# EAGLE design gatedriver_trafo_sma_compact_ACDC (EAGLE 7.2.0)
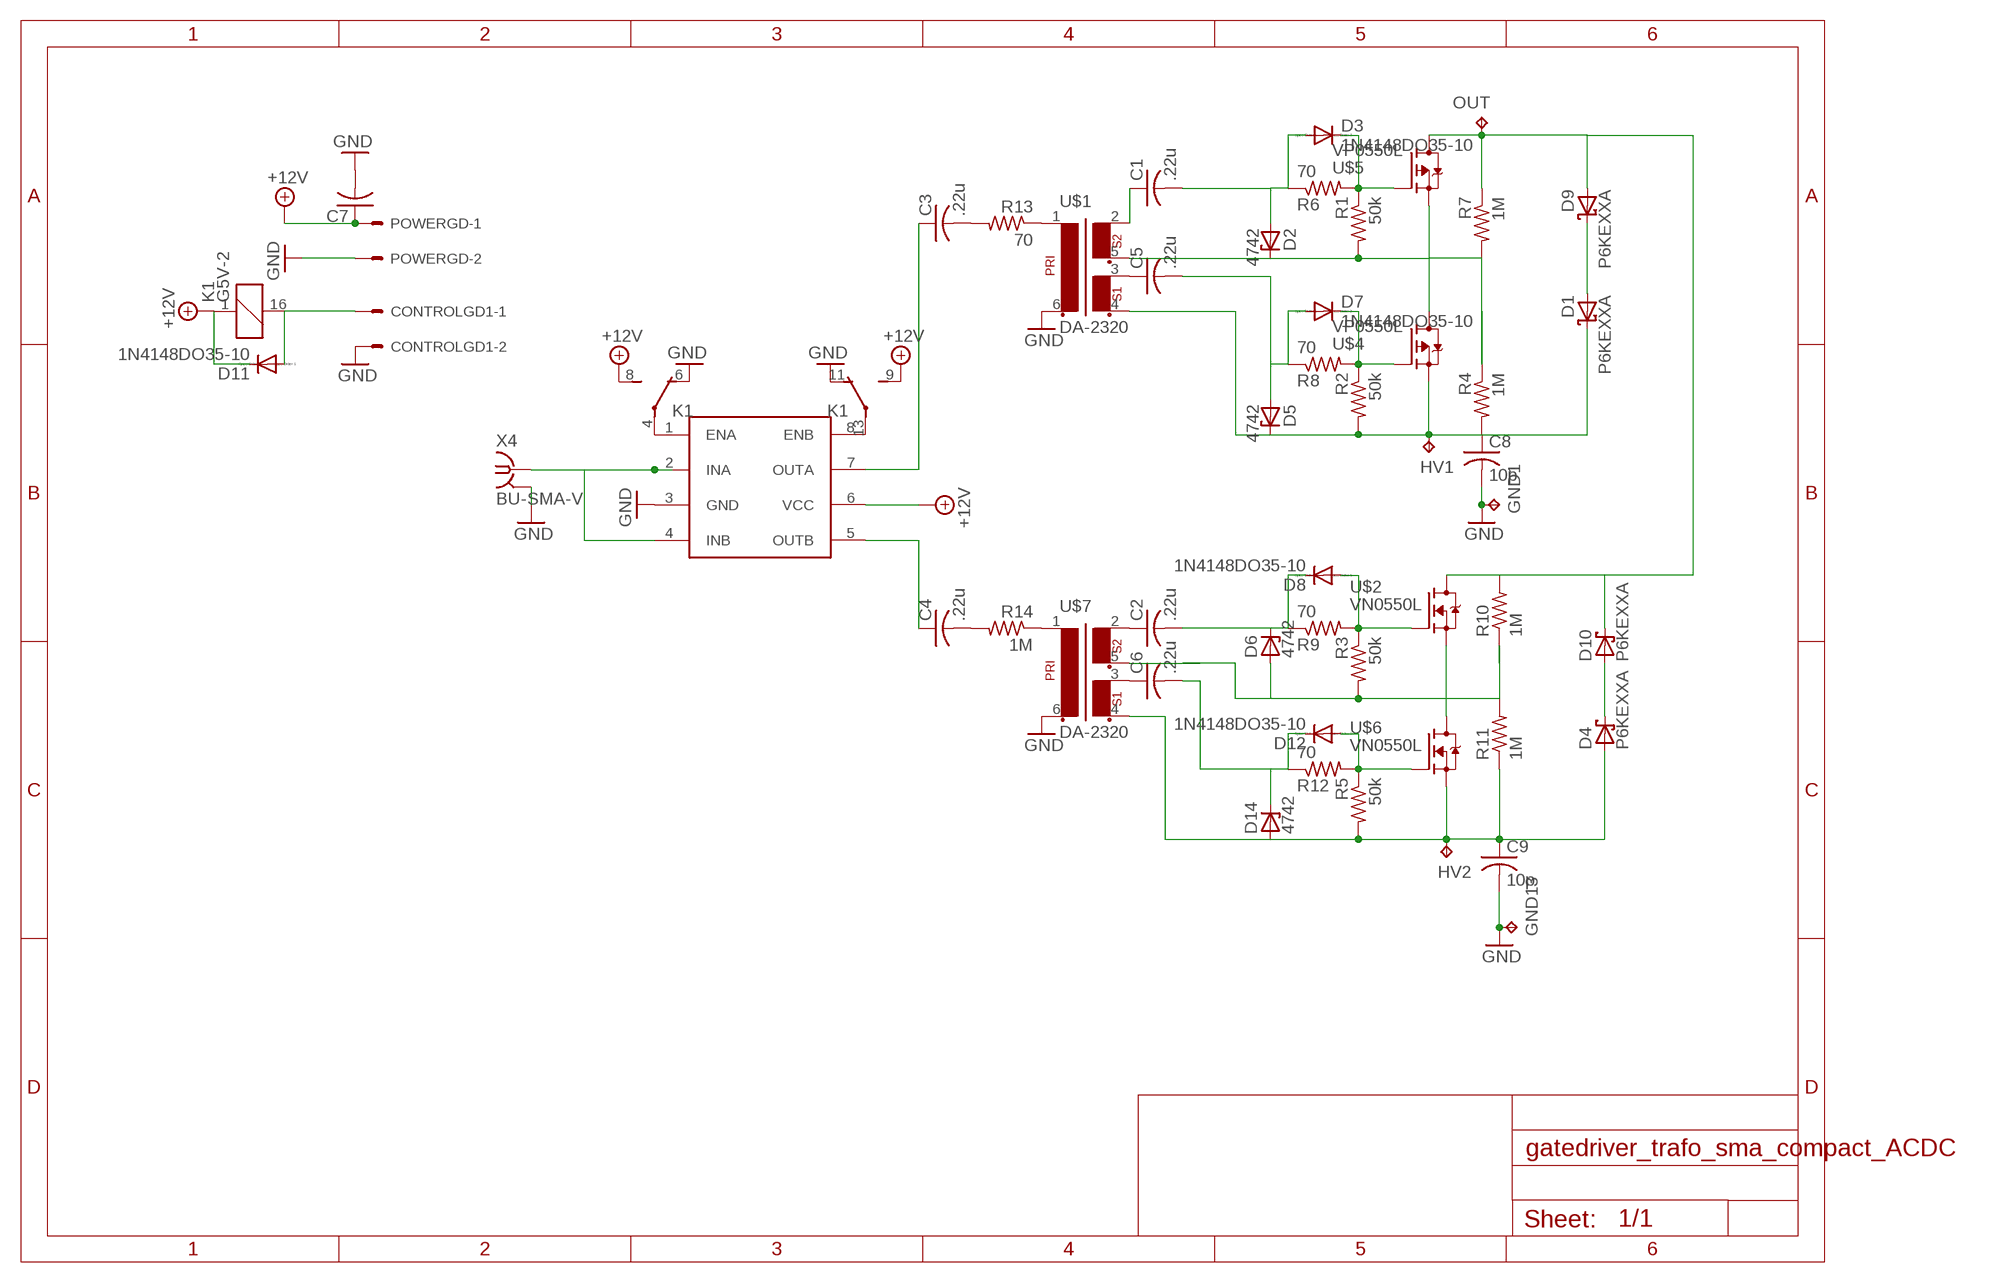
[diagram p0: schematic, sheet 1]

## Parts
C1  .22u  C-US050-055X075  [C050-055X075]
C2  .22u  C-US050-055X075  [C050-055X075]
C3  .22u  C-US050-055X075  [C050-055X075]
C4  .22u  C-US050-055X075  [C050-055X075]
C5  .22u  C-US050-055X075  [C050-055X075]
C6  .22u  C-US050-055X075  [C050-055X075]
C7  C-US050-030X075  [C050-030X075]
C8  10p  C-US102-064X133  [C102-064X133]
C9  10p  C-US102-064X133  [C102-064X133]
CONTROLGD1  KK-156-2  [KK-156-2]
D1  P6KEXXA  [C1702-15]
D2  4742  ZENER-DIODEZD-10  [ZDIO-10]
D3  1N4148DO35-10  [DO35-10]
D4  P6KEXXA  [C1702-15]
D5  4742  ZENER-DIODEZD-10  [ZDIO-10]
D6  4742  ZENER-DIODEZD-10  [ZDIO-10]
D7  1N4148DO35-10  [DO35-10]
D8  1N4148DO35-10  [DO35-10]
D9  P6KEXXA  [C1702-15]
D10  P6KEXXA  [C1702-15]
D11  1N4148DO35-10  [DO35-10]
D12  1N4148DO35-10  [DO35-10]
D14  4742  ZENER-DIODEZD-10  [ZDIO-10]
GND1  TPPAD1-20Y  [P1-20Y]
GND13  TPPAD1-20Y  [P1-20Y]
HV1  TPPAD1-20Y  [P1-20Y]
HV2  TPPAD1-20Y  [P1-20Y]
K1  G5V-2  [G5V-2]
OUT  TPPAD1-20Y  [P1-20Y]
POWERGD  KK-156-2  [KK-156-2]
R1  50k  R-US_0207/10  [0207/10]
R2  50k  R-US_0207/10  [0207/10]
R3  50k  R-US_0207/10  [0207/10]
R4  1M  R-US_0207/10  [0207/10]
R5  50k  R-US_0207/10  [0207/10]
R6  70  R-US_0207/10  [0207/10]
R7  1M  R-US_0207/10  [0207/10]
R8  70  R-US_0207/10  [0207/10]
R9  70  R-US_0207/10  [0207/10]
R10  1M  R-US_0207/10  [0207/10]
R11  1M  R-US_0207/10  [0207/10]
R12  70  R-US_0207/10  [0207/10]
R13  70  R-US_0207/10  [0207/10]
R14  1M  R-US_0207/10  [0207/10]
U$1  DA-2320  [DIL06]
U$2  VN0550L  [TO92L]
U$3  UCC27425  [DIL08]
U$4  VP0550L  [TO92L]
U$5  VP0550L  [TO92L]
U$6  VN0550L  [TO92L]
U$7  DA-2320  [DIL06]
X4  BU-SMA-V  [BU-SMA-V]

## Nets
+15V: C7.1 D11.C K1.1 K1.8(1:S) K1.9(2:S) POWERGD.1 U$3.6(VCC) ; supply symbol labelled +12V
ENSW: CONTROLGD1.1 D11.A K1.16
GND: C7.2 C8.2 C9.2 CONTROLGD1.2 GND1.TP GND13.TP K1.6(1:O) K1.11(2:O) POWERGD.2 U$1.6 U$3.3(GND) U$7.6 X4.2 X4.3 X4.4 X4.5
N$1: U$3.2(INA) U$3.4(INB) X4.1
N$2: C3.1 U$3.7(OUTA)
N$3: R13.1 U$1.1
N$4: C4.1 U$3.5(OUTB)
N$5: C1.1 U$1.2
N$6: R14.1 U$7.1
N$7: C5.1 U$1.3
N$8: D3.C R1.1 R6.2 U$5.2(G)
N$9: U$7.5
N$10: C1.2 D2.A D3.A R6.1
N$11: D12.A R5.1 R12.2 U$6.2(G)
N$12: D7.C R2.1 R8.2 U$4.2(G)
N$13: D6.A R3.2 R10.1 R11.2 U$2.3(S) U$6.1(D)
N$14: K1.4(1:P) U$3.1(ENA)
N$15: K1.13(2:P) U$3.8(ENB)
N$16: C5.2 D5.A D7.A R8.1
N$17: C8.1 D1.C D5.C HV1.TP R2.2 R4.2 U$1.4 U$4.3(S)
N$18: D2.C R1.2 R4.1 R7.2 U$1.5 U$4.1(D) U$5.3(S)
N$19: C3.2 R13.2
N$20: C4.2 R14.2
N$21: D9.A D10.C OUT.TP R7.1 R10.2 U$2.1(D) U$5.1(D)
N$22: C2.1 U$7.2
N$23: C6.1 U$7.3
N$24: C9.1 D4.A D14.A HV2.TP R5.2 R11.1 U$6.3(S) U$7.4
N$25: C2.2 D6.C D8.C R9.1
N$26: D1.A D9.C
N$27: C6.2 D12.C D14.C R12.1
N$28: D4.C D10.A
N$251: D8.A R3.1 R9.2 U$2.2(G)

## Library data of the parts
C1-C6 C8 C9 = resistor:C-US: CAPACITOR, American symbol
C7 = rcl:C-US: CAPACITOR, American symbol
CONTROLGD1 POWERGD = con-molex:KK-156-2: KK 156 HEADER Source: http://www.molex.com/pdm_docs/sd/026604100_sd.pdf; OC_FARNELL: unknown; OC_NEWARK: unknown
D1 D4 D9 D10 = diode:P6KEXXA: DIODE transient-voltage suppressor
D2 D5 D6 D14 = diode:ZENER-DIODE: Z-Diode
D3 D7 D8 D11 D12 = diode:1N4148: DIODE high speed (Philips)
GND1 GND13 HV1 HV2 OUT = testpad:TP: Test pad
K1 = relay:G5V-2: OMRON PCB Relay Source: http://www.omron.com/ecb/products/pdf/en-g5v2.pdf; MPN: G5V-2 5DC; OC_FARNELL: 9949488; OC_NEWARK: 78K5703
R1-R14 = rcl:R-US_: RESISTOR, American symbol
U$1 U$7 = trafo:DA-2320
U$2 U$6 = transistor-fet:VN0550
U$3 = texas:UCC27425
U$4 U$5 = transistor-fet:VP0550
X4 = con-coax:BU-SMA-V: FEMALE SMA CONNECTOR Radiall distributor RS 112-3794; OC_FARNELL: unknown; OC_NEWARK: unknown

## Board
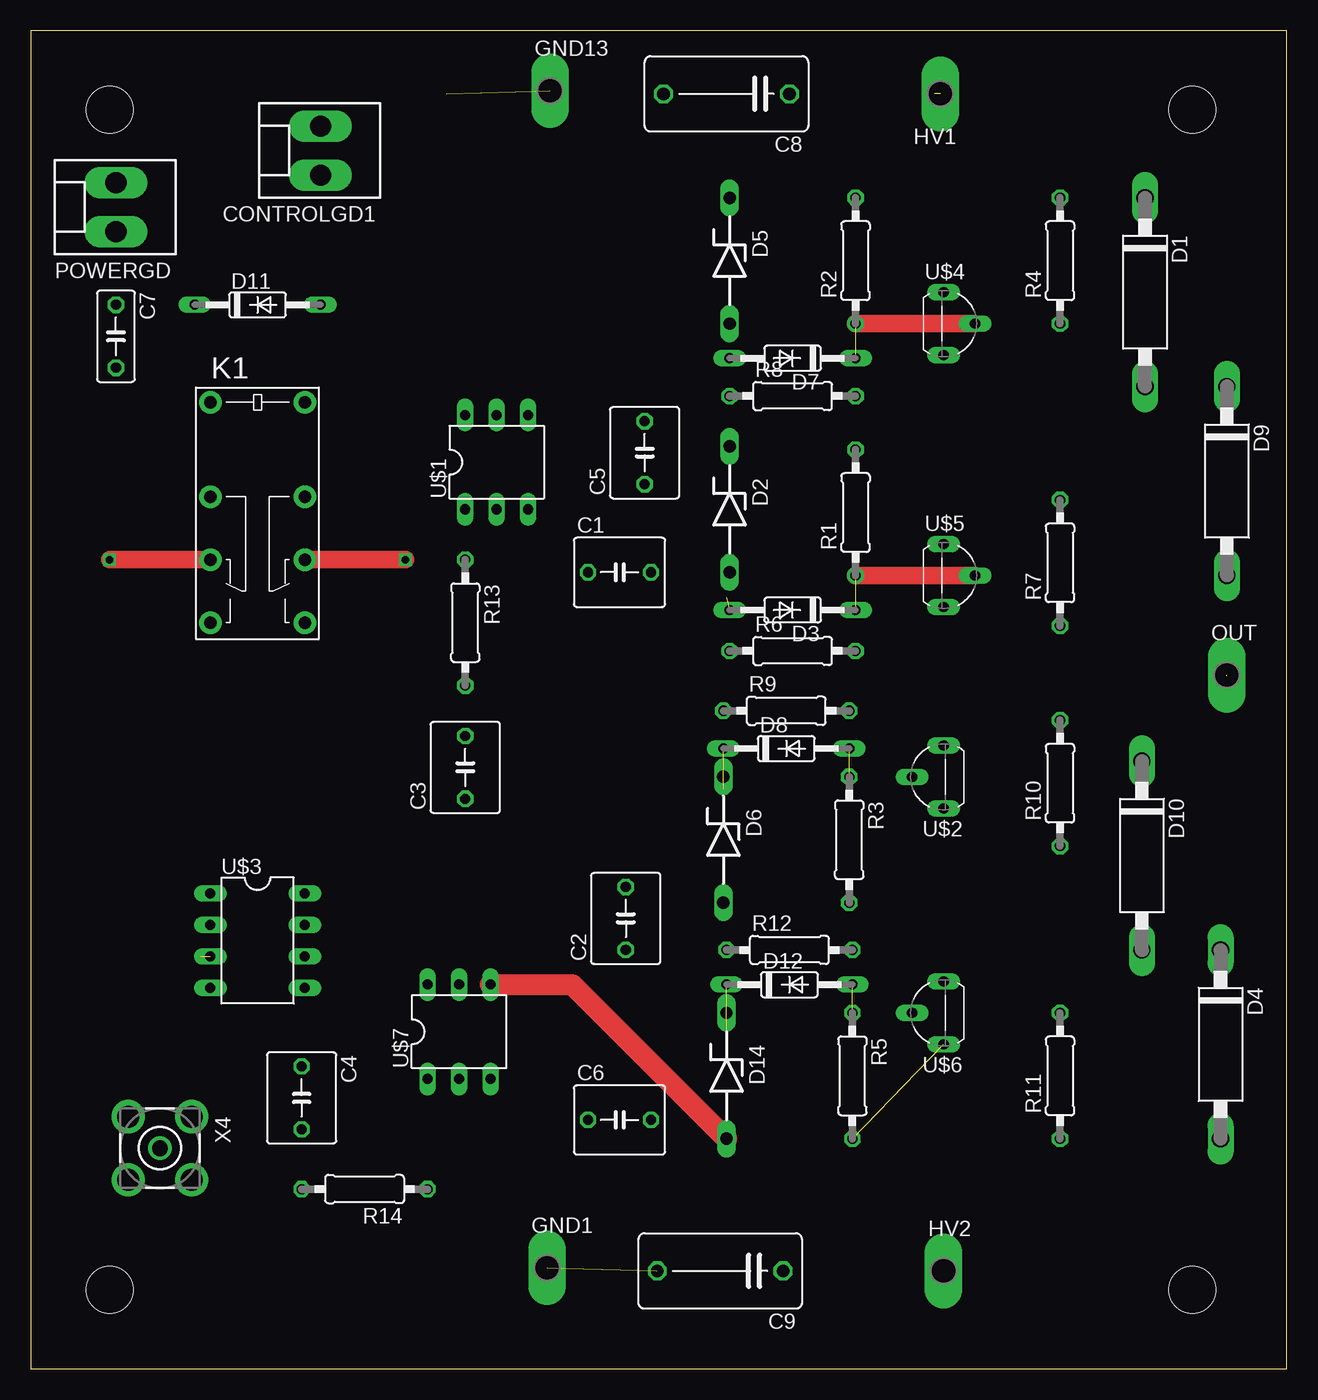
[diagram p1: board, top side]
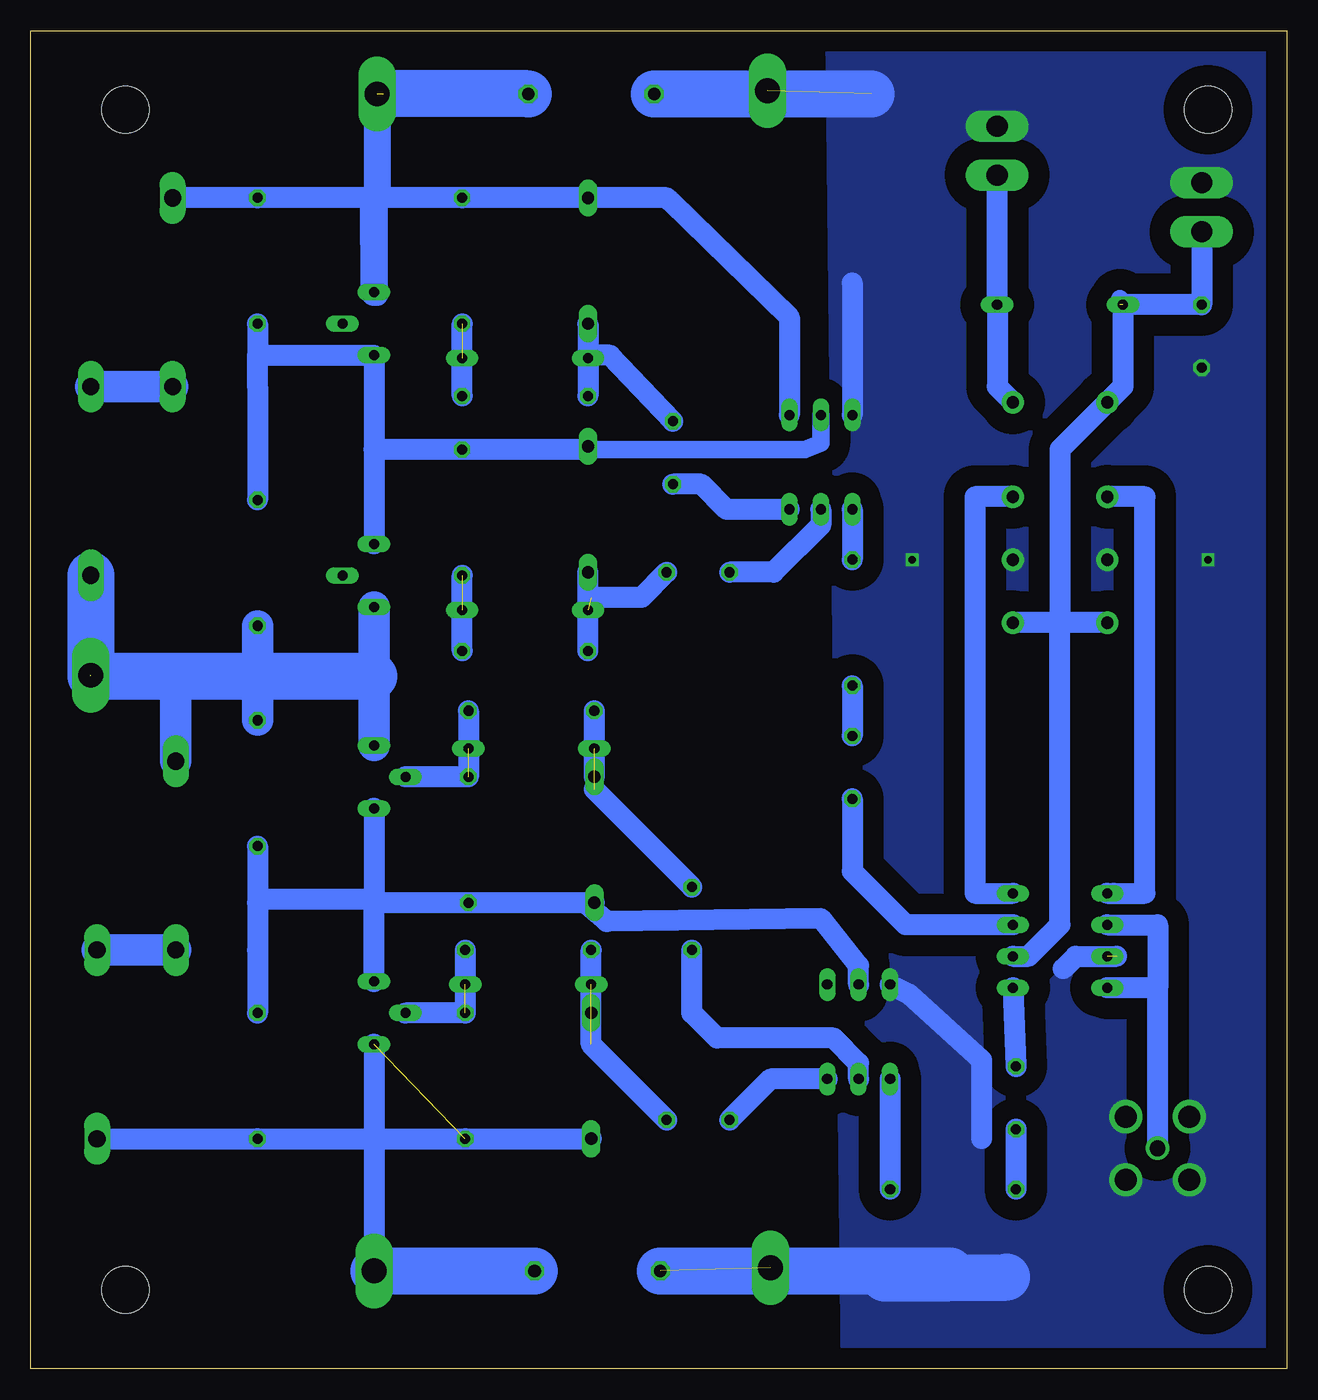
[diagram p2: board, bottom side, seen from below]

Size 101.35 x 107.95 mm. Coordinates in mm from the lower left corner, seen from the top.
Outline: 0,0 101.35,0 101.35,107.95 0,107.95 0,0
Copper layers (1*16): Top 0.035mm / dielectric 1.5mm / Bottom 0.035mm
Design rules "default": minimum track width 10mil, minimum drill 24mil, track to track 8mil, track to pad 8mil, pad to pad 8mil, via to via 8mil, smd to smd 8mil, copper to edge 40mil, drill to drill 8mil, minimum pad ring 10mil, minimum via ring 8mil, stop-mask expansion 4mil, vias tented up to drill 0mil, thermal gap 10mil
Holes 3.8 mm at 93.73,101.6 93.73,6.35 6.35,6.35 6.35,101.6

### Footprints (pad centres in the part's own frame; a part is rotated, then mirrored left to right if it is on the bottom)
C050-055X075 = drill 0.813 octagon: 1 -2.54,0; 2 2.54,0
C050-030X075 = drill 0.813 octagon: 1 -2.54,0; 2 2.54,0
C102-064X133 = drill 1.016 octagon: 1 -5.08,0; 2 5.08,0
KK-156-2 = drill 1.7 pad 2.184 long: 1 -1.98,0; 2 1.98,0
C1702-15 = drill 1.397 long: A 7.62,0; C -7.62,0
ZDIO-10 = drill 1 long: A 5.08,0; C -5.08,0
DO35-10 = drill 0.813 long: A 5.08,0; C -5.08,0
P1-20Y = drill 2.007 pad 2.54 long: TP 0,0
G5V-2 = drill 1 pad 1.8: 1 -8.89,-3.81; 4 -1.27,-3.81; 6 3.81,-3.81; 8 8.89,-3.81; 9 8.89,3.81; 11 3.81,3.81; 13 -1.27,3.81; 16 -8.89,3.81
0207/10 = drill 0.813 octagon: 1 -5.08,0; 2 5.08,0
DIL06 = drill 0.813 long: 1 -2.54,-3.81; 2 0,-3.81; 3 2.54,-3.81; 4 2.54,3.81; 5 0,3.81; 6 -2.54,3.81
TO92L = drill 0.813 long: 1 0,-2.54; 2 2.54,0; 3 0,2.54
DIL08 = drill 0.813 long: 1 -3.81,-3.81; 2 -1.27,-3.81; 3 1.27,-3.81; 4 3.81,-3.81; 5 3.81,3.81; 6 1.27,3.81; 7 -1.27,3.81; 8 -3.81,3.81
BU-SMA-V = drill 1.27: 1 0,0 | drill 1.778: 2 -2.55,2.55; 3 2.55,2.55; 4 2.55,-2.55; 5 -2.55,-2.55

### Placement (x,y rotation side)
C1  47.5,64.26 0 top
C2  48.01,36.32 90 top
C3  35.05,48.51 90 top
C4  21.84,21.84 270 top
C5  49.53,73.91 90 top
C6  47.5,20.07 0 top
C7  6.86,83.31 270 top
C8  56.13,102.87 180 top
C9  55.63,7.87 180 top
CONTROLGD1  23.37,98.3 90 top
D1  89.92,86.87 270 top
D2  56.39,69.34 270 top
D3  61.47,61.21 180 top
D4  96.01,26.16 270 top
D5  56.39,89.41 270 top
D6  55.88,42.67 270 top
D7  61.47,81.53 180 top
D8  60.96,50.04 0 top
D9  96.52,71.63 270 top
D10  89.66,41.4 270 top
D11  18.29,85.85 0 top
D12  61.21,30.99 0 top
D14  56.13,23.62 270 top
GND1  41.66,8.13 0 top
GND13  41.91,103.12 0 top
HV1  73.41,102.87 180 top
HV2  73.66,7.87 0 top
K1  18.29,69.09 270 top
OUT  96.52,55.96 0 top
POWERGD  6.86,93.73 90 top
R1  66.55,69.09 90 top
R2  66.55,89.41 90 top
R3  66.04,42.67 270 top
R4  83.06,89.41 90 top
R5  66.29,23.62 270 top
R6  61.47,57.91 0 top
R7  83.06,65.02 90 top
R8  61.47,78.49 0 top
R9  60.96,53.09 0 top
R10  83.06,47.24 90 top
R11  83.06,23.62 90 top
R12  61.21,33.78 0 top
R13  35.05,60.2 270 top
R14  26.92,14.48 180 top
U$1  37.59,73.15 0 top
U$2  73.66,47.75 180 top
U$3  18.29,34.54 270 top
U$4  73.66,84.33 0 top
U$5  73.66,64.01 0 top
U$6  73.66,28.7 180 top
U$7  34.54,27.18 0 top
X4  10.41,17.78 270 top

### Tracks (layer width: path | path; a pad name or v marks a point on that pad's centre or on a via)
+15V  (1 unrouted)
  Bottom 1.422: 13.46,85.85 13.46,86.36
  Bottom 1.676: D11.C 13.21,79.25 K1.1 18.29,74.17 18.29,60.2 | 18.29,60.2 18.29,35.81 20.83,33.27 U$3.6 | 18.29,60.2 K1.9 | K1.8 18.29,60.2 | POWERGD.1 C7.1 13.46,85.85
ENSW
  Bottom 1.676: CONTROLGD1.1 D11.A 23.37,79.25 K1.16
GND  (via drill 0.6)  (3 unrouted)
  Top 1.422: K1.11 v30.23,65.28 | K1.6 v6.35,65.28
  Bottom 1.676: 35.05,87.63 U$1.6 | U$7.6 30.48,30.23 24.64,24.89 24.64,18.54 | 18.03,32.26 17.02,33.27 13.72,33.27
  Bottom 3.81: 32.46,7.32 27.18,7.34 | 27.18,7.34 22.61,7.37 | C8.2 33.53,102.87 | C9.2 27.18,7.87 27.18,7.34
  pour Bottom (isolate 1.676, no thermals): 0.25,107.7 37.08,107.7 35.81,0 0.25,0
N$1
  Bottom 1.676: X4.1 10.41,30.73 | U$3.2 10.41,35.81 10.41,30.73 | 10.41,30.73 U$3.4
N$2
  Bottom 1.676: U$3.7 30.73,35.81 35.05,40.13 C3.1
N$3
  Bottom 1.676: U$1.1 R13.1
N$4
  Bottom 1.676: U$3.5 C4.1
N$5
  Bottom 1.676: U$1.2 37.59,68.07 41.4,64.26 C1.1
N$6
  Bottom 1.676: U$7.1 R14.1
N$7
  Bottom 1.676: U$1.3 45.21,69.34 47.24,71.37 C5.1
N$8  (1 unrouted)
  Top 1.422: U$5.2 R1.1
  Bottom 1.676: R6.2 R1.1
N$9
  Bottom 1.676: U$7.5 34.54,32.51 37.59,36.32 54.86,36.07 56.64,37.59 59.44,37.59
N$10  (1 unrouted)
  Bottom 1.676: C1.2 52.07,62.23 56.13,62.23 56.39,62.48 | 56.39,62.48 D2.A | R6.1 56.39,62.48
N$11  (1 unrouted)
  Bottom 1.676: R12.2 R5.1 U$6.2
N$12  (1 unrouted)
  Top 1.422: U$4.2 R2.1
  Bottom 1.676: R8.2 R2.1
N$13
  Bottom 1.676: U$2.3 73.66,37.59 | R10.1 83.06,37.59 | 83.06,37.59 83.06,33.78 R11.2 | D6.A R3.2 73.66,37.59 | U$6.1 73.66,37.59 | 73.66,37.59 73.41,37.85 82.8,37.85 83.06,37.59
N$14
  Bottom 1.676: 13.97,38.35 U$3.1 11.43,38.35 11.43,70.36 K1.4
N$15
  Bottom 1.676: K1.13 25.15,70.36 25.15,38.35 U$3.8
N$16
  Bottom 1.676: C5.2 54.61,81.79 56.13,81.79 D7.A | D7.A R8.1 | D5.A D7.A
N$17  (1 unrouted)
  Bottom 1.676: 73.41,94.49 73.41,86.61 U$4.3 | 73.41,94.49 73.68,94.48 73.42,94.23 73.41,94.49 | 73.41,94.49 R4.2 D1.C | U$1.4 40.13,84.84 49.78,94.23 50.04,94.49 D5.C R2.2 73.41,94.49
  Bottom 2.184: U$4.3 73.68,94.48 | HV1.TP 73.41,94.49
  Bottom 3.81: C8.1 72.9,102.87
N$18
  Bottom 1.422: U$1.5 37.59,74.68 38.86,74.17 R1.2
  Bottom 1.676: 73.66,74.17 U$4.1 83.06,81.79 | 73.66,74.17 U$5.3 | 83.06,81.79 83.06,79.25 R7.2 | R4.1 83.06,81.79 | D2.C 56.64,74.17 R1.2 73.66,74.17
N$19
  Bottom 1.676: R13.2 C3.2
N$20
  Bottom 1.676: C4.2 R14.2
N$21  (1 unrouted)
  Bottom 2.54: U$5.1 73.66,55.88 U$2.1 | R10.2 83.06,55.88 R7.1 | D10.C 89.66,55.88
  Bottom 3.81: D9.A 96.52,55.88 89.66,55.88 83.06,55.88 73.66,55.88
N$22
  Bottom 1.676: U$7.2 34.54,24.64 36.58,26.67 45.97,26.67 48.01,28.7 C2.1
N$23
  Bottom 1.676: U$7.3 41.66,23.37 C6.1
N$24  (1 unrouted)
  Top 1.676: U$7.4 43.69,30.99 D14.A
  Bottom 1.676: D4.A R11.1 R5.2 D14.A | 73.66,7.62 HV2.TP U$6.3
  Bottom 3.81: HV2.TP C9.1
N$25  (2 unrouted)
  Bottom 1.676: C2.2 55.88,46.74 | D6.C R9.1
N$26
  Bottom 2.54: D1.A D9.C
N$27  (2 unrouted)
  Bottom 1.676: C6.2 56.13,26.16 R12.1
N$28
  Bottom 2.54: D4.C D10.A
N$251  (1 unrouted)
  Bottom 1.676: R9.2 R3.1 U$2.2